# EAGLE design row_driver (EAGLE 7.7.0)
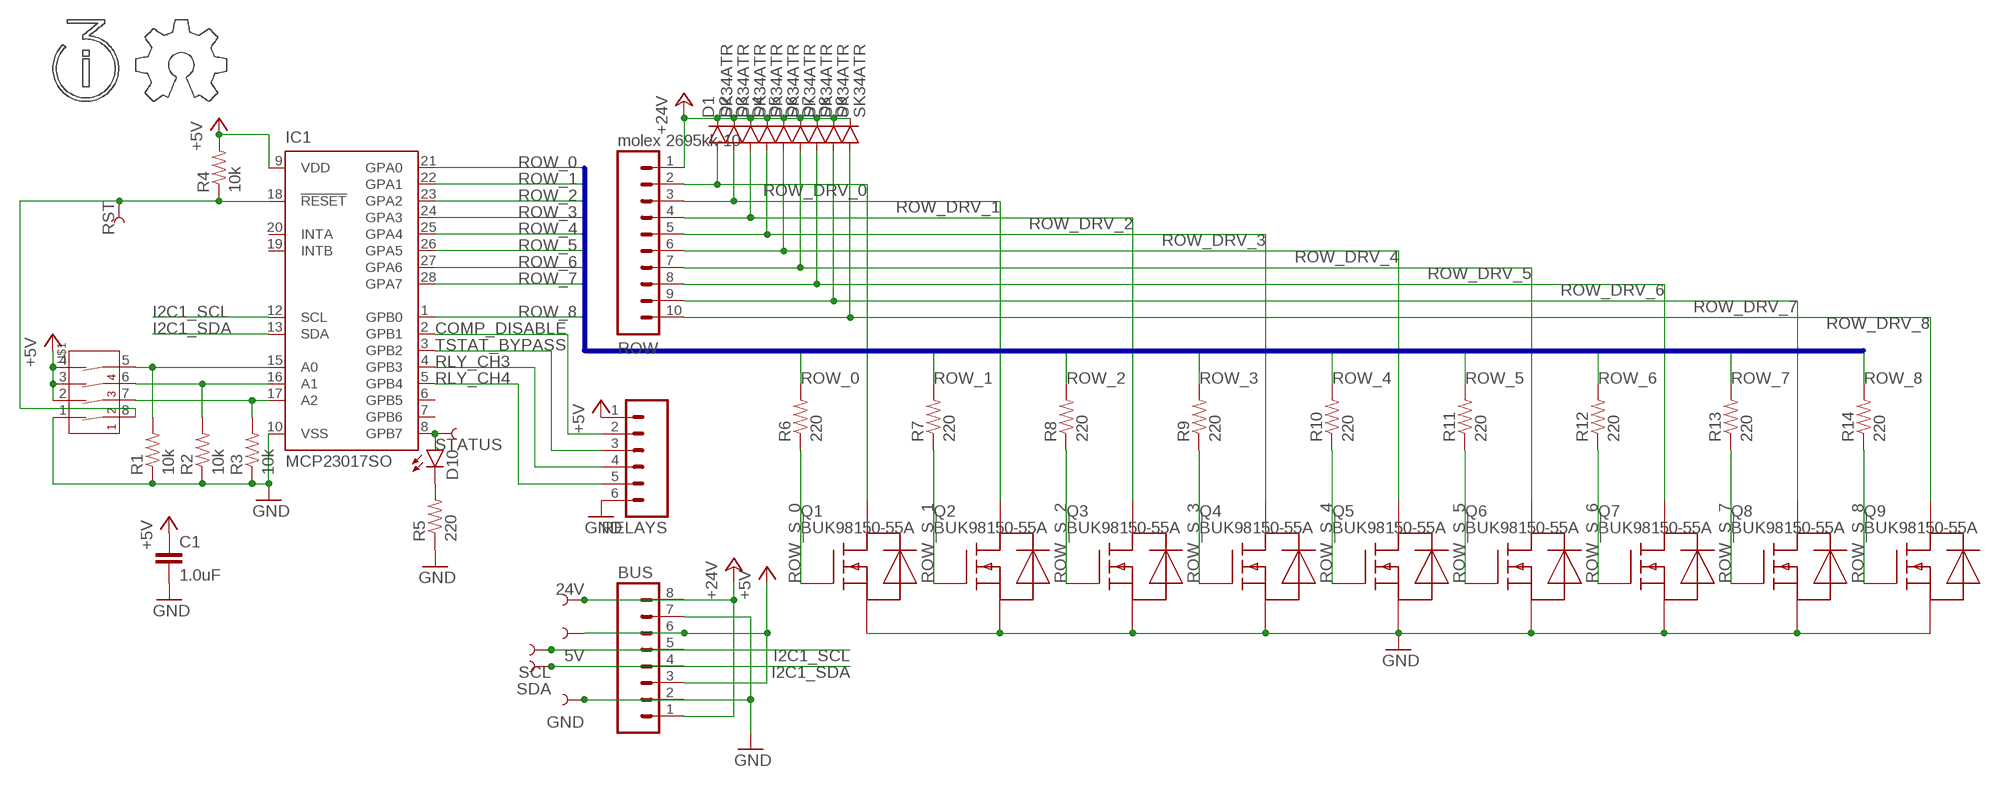
[diagram p0: schematic, sheet 1]

## Parts
5V  TEST-POINTTP_15TH_THRU  [TP_15TH]
24V  TEST-POINTTP_15TH_THRU  [TP_15TH]
BUS  M08FEMALE_LOCK  [1X08_FEMALE_LOCK]
C1  1.0uF  1.0UF-16V-10%(0603)  [0603-CAP]
D1  SK34ATR  DIODESMA  [SMA-DIODE]
D2  SK34ATR  DIODESMA  [SMA-DIODE]
D3  SK34ATR  DIODESMA  [SMA-DIODE]
D4  SK34ATR  DIODESMA  [SMA-DIODE]
D5  SK34ATR  DIODESMA  [SMA-DIODE]
D6  SK34ATR  DIODESMA  [SMA-DIODE]
D7  SK34ATR  DIODESMA  [SMA-DIODE]
D8  SK34ATR  DIODESMA  [SMA-DIODE]
D9  SK34ATR  DIODESMA  [SMA-DIODE]
D10  LED1206  [LED-1206]
GND  TEST-POINTTP_15TH_THRU  [TP_15TH]
IC1  MCP23017SO  [SO28W]
Q1  BUK98150-55A  [SOT223]
Q2  BUK98150-55A  [SOT223]
Q3  BUK98150-55A  [SOT223]
Q4  BUK98150-55A  [SOT223]
Q5  BUK98150-55A  [SOT223]
Q6  BUK98150-55A  [SOT223]
Q7  BUK98150-55A  [SOT223]
Q8  BUK98150-55A  [SOT223]
Q9  BUK98150-55A  [SOT223]
R1  10k  RESISTOR0805-RES  [0805]
R2  10k  RESISTOR0805-RES  [0805]
R3  10k  RESISTOR0805-RES  [0805]
R4  10k  RESISTOR0805-RES  [0805]
R5  220  RESISTOR0805-RES  [0805]
R6  220  RESISTOR0805-RES  [0805]
R7  220  RESISTOR0805-RES  [0805]
R8  220  RESISTOR0805-RES  [0805]
R9  220  RESISTOR0805-RES  [0805]
R10  220  RESISTOR0805-RES  [0805]
R11  220  RESISTOR0805-RES  [0805]
R12  220  RESISTOR0805-RES  [0805]
R13  220  RESISTOR0805-RES  [0805]
R14  220  RESISTOR0805-RES  [0805]
RELAYS  M06LOCK  [1X06_LOCK]
ROW  molex 2695kk-10  M10LOCK  [1X10_LOCK]
RST  TEST-POINTTP_15TH_THRU  [TP_15TH]
SCL  TEST-POINTTP_15TH_THRU  [TP_15TH]
SDA  TEST-POINTTP_15TH_THRU  [TP_15TH]
STATUS  TEST-POINTTP_15TH_THRU  [TP_15TH]
U$1  4-POS-DIP  [4-POS-DIP-SMD]
U$2  I3LOGO  [I3LOGO]
U$4  OSHWLOGO  [OSHWLOGO]

## Nets
+5V: 5V.P$1 BUS.3 BUS.6 C1.1 IC1.9(VDD) R4.2 RELAYS.1 U$1.2(2A) U$1.3(3A) U$1.4(4A)
+24V: 24V.P$1 BUS.1 BUS.8 D1.C D2.C D3.C D4.C D5.C D6.C D7.C D8.C D9.C ROW.1
A0: IC1.15(A0) R1.2 U$1.5(4B)
A1: IC1.16(A1) R2.2 U$1.6(3B)
A2: IC1.17(A2) R3.2 U$1.7(2B)
COMP_DISABLE: IC1.2(GPB1) RELAYS.2
GND: BUS.2 BUS.7 C1.2 GND.P$1 IC1.10(VSS) Q1.3(S) Q2.3(S) Q3.3(S) Q4.3(S) Q5.3(S) Q6.3(S) Q7.3(S) Q8.3(S) Q9.3(S) R1.1 R2.1 R3.1 R5.1 RELAYS.6 U$1.1(1A)
I2C1_SCL: BUS.5 IC1.12(SCL) SCL.P$1
I2C1_SDA: BUS.4 IC1.13(SDA) SDA.P$1
N$15: D10.C R5.2
RLY_CH3: IC1.4(GPB3) RELAYS.4
RLY_CH4: IC1.5(GPB4) RELAYS.5
ROW_0: IC1.21(GPA0) R6.2
ROW_1: IC1.22(GPA1) R7.2
ROW_2: IC1.23(GPA2) R8.2
ROW_3: IC1.24(GPA3) R9.2
ROW_4: IC1.25(GPA4) R10.2
ROW_5: IC1.26(GPA5) R11.2
ROW_6: IC1.27(GPA6) R12.2
ROW_7: IC1.28(GPA7) R13.2
ROW_8: IC1.1(GPB0) R14.2
ROW_DRV_0: D1.A Q1.2(D) Q1.4(D) ROW.2
ROW_DRV_1: D2.A Q2.2(D) Q2.4(D) ROW.3
ROW_DRV_2: D3.A Q3.2(D) Q3.4(D) ROW.4
ROW_DRV_3: D4.A Q4.2(D) Q4.4(D) ROW.5
ROW_DRV_4: D5.A Q5.2(D) Q5.4(D) ROW.6
ROW_DRV_5: D6.A Q6.2(D) Q6.4(D) ROW.7
ROW_DRV_6: D7.A Q7.2(D) Q7.4(D) ROW.8
ROW_DRV_7: D8.A Q8.2(D) Q8.4(D) ROW.9
ROW_DRV_8: D9.A Q9.2(D) Q9.4(D) ROW.10
ROW_S_0: Q1.1(G) R6.1
ROW_S_1: Q2.1(G) R7.1
ROW_S_2: Q3.1(G) R8.1
ROW_S_3: Q4.1(G) R9.1
ROW_S_4: Q5.1(G) R10.1
ROW_S_5: Q6.1(G) R11.1
ROW_S_6: Q7.1(G) R12.1
ROW_S_7: Q8.1(G) R13.1
ROW_S_8: Q9.1(G) R14.1
RST: IC1.18(!RESET) R4.1 RST.P$1 U$1.8(1B)
STATUS: D10.A IC1.8(GPB7) STATUS.P$1
TSTAT_BYPASS: IC1.3(GPB2) RELAYS.3
Unconnected: IC1.6(GPB5) IC1.7(GPB6) IC1.19(INTB) IC1.20(INTA)

## Buses
ROW_[0..8]

## Library data of the parts
5V 24V GND RST SCL SDA STATUS = SparkFun-Passives:TEST-POINT: Bare copper test points for troubleshooting or ICT
BUS = SparkFun-Connectors:M08: Header 8 Standard 8-pin 0.1" header. Use with straight break away headers (SKU : PRT-00116), right angle break away headers (PRT-00553), swiss pins (PRT-00743), machine pins (PRT-00117), and female headers (PRT-00115).
C1 = SparkFun-Capacitors:1.0UF-16V-10%(0603): CAP-00868; PROD_ID: CAP-00868
D1-D9 = SparkFun-DiscreteSemi:DIODE: Diode These are standard reverse protection diodes and small signal diodes. SMA package can handle up to about 1A. SOD-323 can handle about 200mA. What the SOD-323 package when ordering, there are some mfgs out there that are 5-pin packages.
D10 = SparkFun-LED:LED: LEDs Standard schematic elements and footprints for 5mm, 3mm, 1206, and 0603 sized LEDs. 5mm - Spark Fun Electronics SKU : COM-00529 (and others)
IC1 = microchip:MCP23017: http://ww1.microchip.com/downloads/en/DeviceDoc/21952a.pdf Source: http://ww1.microchip.com/downloads/en/DeviceDoc/21952a.pdf; MF: MICROCHIP; MPN: MCP23017-E/SO; OC_FARNELL: 1332087; OC_NEWARK: 31K2958
Q1-Q9 = vending:BUK98150-55A: N-channel TrenchMOS logic level FET Logic level N-channel enhancement mode Field-Effect Transistor (FET) in a plastic package using TrenchMOS technology. SOT223
R1-R14 = SparkFun-Passives:RESISTOR: Resistor Basic schematic elements and footprints for 0603, 1206, and PTH resistors.
RELAYS = SparkFun-Connectors:M06: Header 6 Standard 6-pin 0.1" header. Use with straight break away headers (SKU : PRT-00116), right angle break away headers (PRT-00553), swiss pins (PRT-00743), machine pins (PRT-00117), and female headers (PRT-00115). Molex polarized connector foot print use with SKU : PRT-08094 with associated crimp pins and housings. NOTES ON THE VARIANTS LOCK and LOCK_LONGPADS... This footprint was designed to help hold the alignment of a through-hole component (i.e. 6-pin header) while soldering it into place. You may notice that each hole has been shifted either up or down by 0.005 of an inch from it's more standard position (which is a perfectly straight line). This slight alteration caused the pins (the squares in the middle) to touch the edges of the holes. Because they are alternating, it causes a "brace" to hold the component in place. 0.005 has proven to be the perfect amount of "off-center" position when using our standard breakaway headers. Although looks a little odd when you look at the bare footprint, once you have a header in there, the alteration is very hard to notice. Also,if you push a header all the way into place, it is covered up entirely on the bottom side. This idea of altering the position of holes to aid alignment will be further integrated into the Sparkfun Library for other footprints. It can help hold any component with 3 or more connection pins.
ROW = SparkFun-Connectors:M10: Header 10 Standard 10-pin 0.1" header. Use with straight break away headers (SKU : PRT-00116), right angle break away headers (PRT-00553), swiss pins (PRT-00743), machine pins (PRT-00117), and female headers (PRT-00115).
U$1 = SparkFun-Electromechanical:4-POS-DIP: 4 Position DIP Switch CTS series 219; PROD_ID: SWCH-12418
U$2 = vending:I3LOGO: The i3Detroit square logo ("i3") as lines in the Info/tNames layers
U$4 = vending:OSHWLOGO: The OSHW logo as lines on Info/tNames layers

## Board
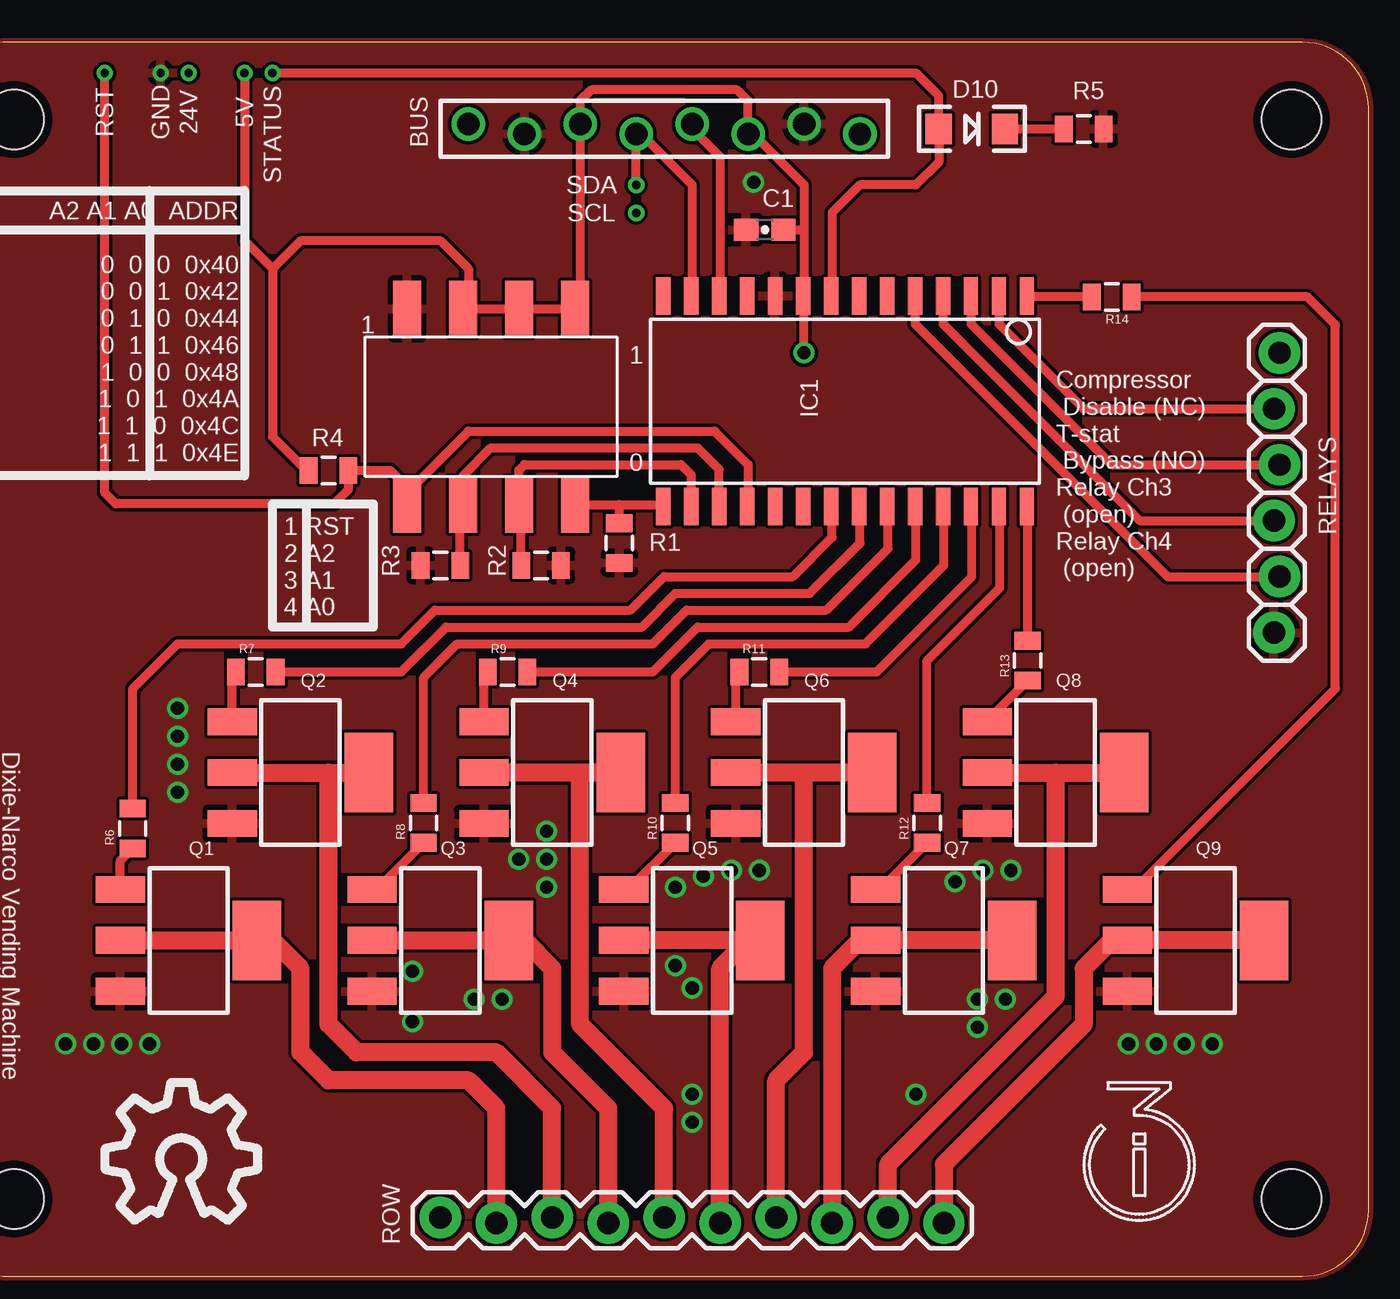
[diagram p1: board, top side]
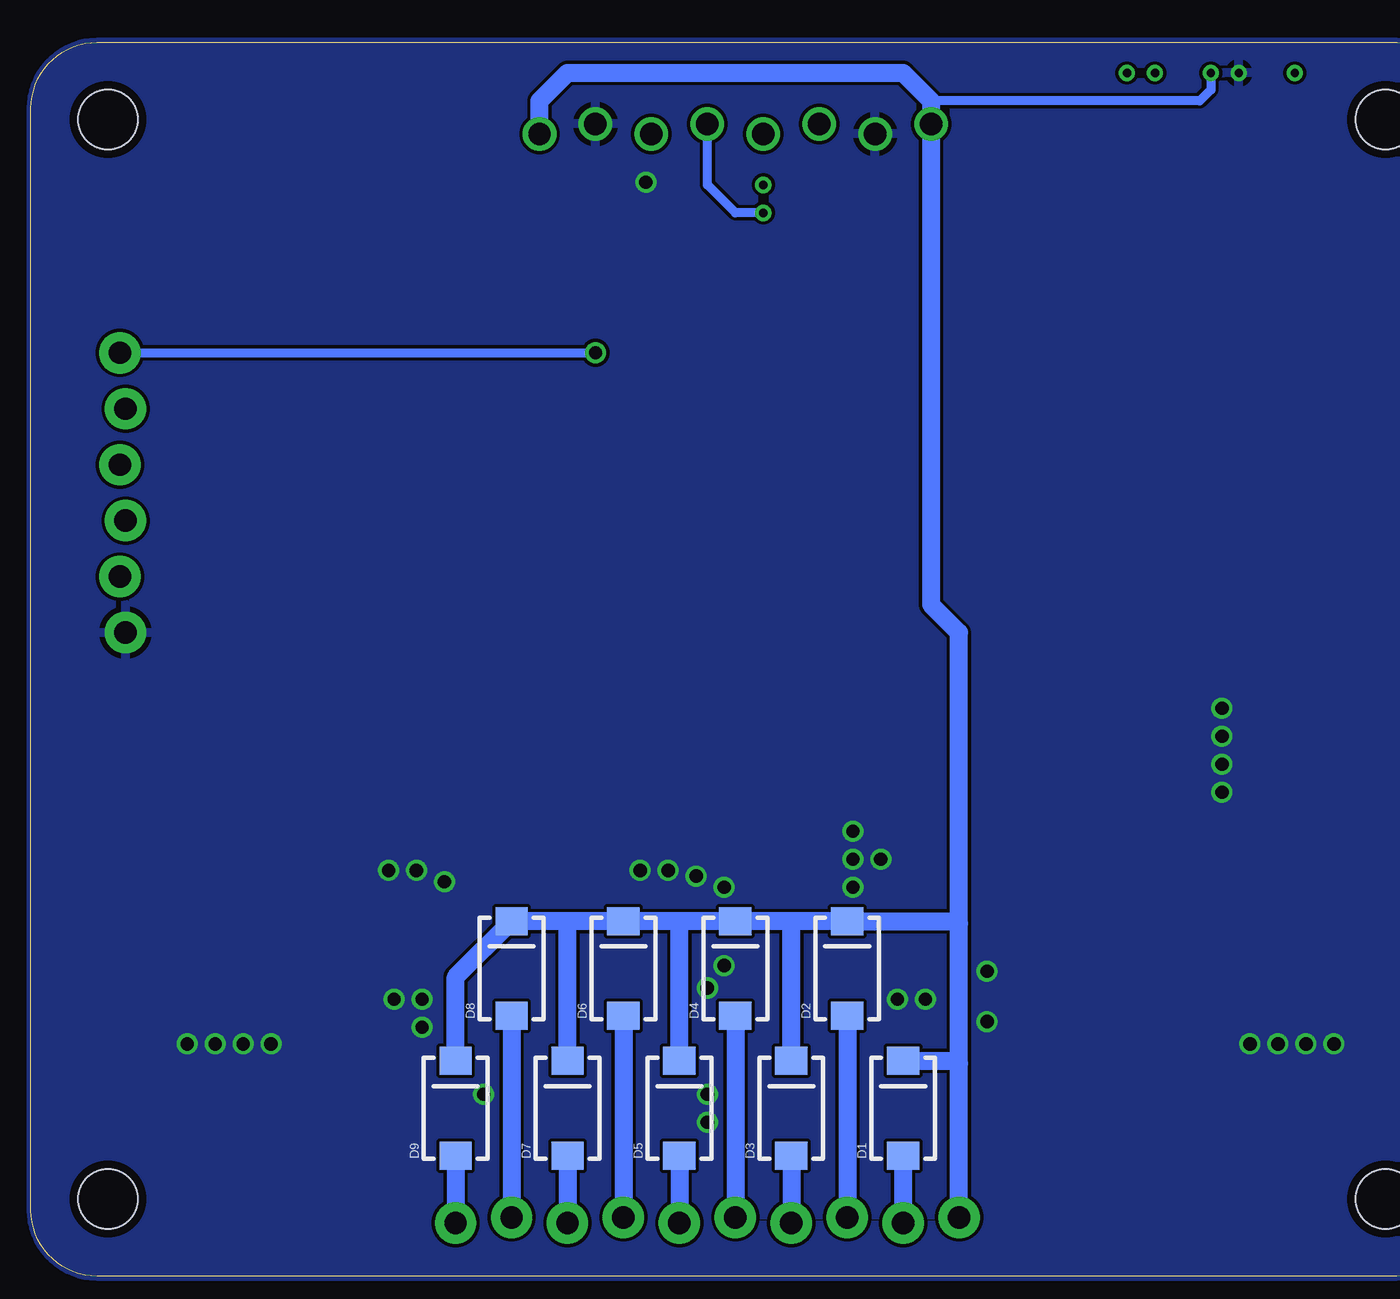
[diagram p2: board, bottom side, seen from below]

No outline drawn. Coordinates in mm, seen from the top.
Copper layers (1*16): Top 0.0356mm / dielectric 1.5011mm / Bottom 0.0356mm
Design rules "LaenPCBOrder": minimum track width 6mil, minimum drill 13mil, track to track 6mil, track to pad 6mil, pad to pad 6mil, via to via 6mil, smd to smd 6mil, copper to edge 15mil, drill to drill 6mil, minimum pad ring 7mil, minimum via ring 7mil, stop-mask expansion 4mil, vias tented up to drill 0mil, thermal gap 10mil
Holes 2.7 mm at 3.5,3.5 3.5,52.5 61.5,52.5 61.5,3.5
Milling: 8 lines

### Footprints (pad centres in the part's own frame; a part is rotated, then mirrored left to right if it is on the bottom)
TP_15TH = drill 0.381 pad 0.61: P$1 0,0
1X08_FEMALE_LOCK = drill 1.016: 1 0,0.229; 2 2.54,-0.229; 3 5.08,0.229; 4 7.62,-0.229; 5 10.16,0.229; 6 12.7,-0.229; 7 15.24,0.229; 8 17.78,-0.229
0603-CAP = smd 1.1 x 1: 1 -0.85,0; 2 0.85,0
SMA-DIODE = smd 1.27 x 1.47: A -2.15,0; C 2.15,0
LED-1206 = smd 1.2 x 1.4: A -1.5,0; C 1.5,0
SO28W = smd 0.65 x 1.7: 1 -7.62,-4.78; 2 -6.35,-4.78; 3 -5.08,-4.78; 4 -3.81,-4.78; 5 -2.54,-4.78; 6 -1.27,-4.78; 7 0,-4.78; 8 1.27,-4.78; 9 2.54,-4.78; 10 3.81,-4.78; 11 5.08,-4.78; 12 6.35,-4.78; 13 7.62,-4.78; 14 8.89,-4.78; 15 8.89,4.78; 16 7.62,4.78; 17 6.35,4.78; 18 5.08,4.78; 19 3.81,4.78; 20 2.54,4.78; 21 1.27,4.78; 22 0,4.78; 23 -1.27,4.78; 24 -2.54,4.78; 25 -3.81,4.78; 26 -5.08,4.78; 27 -6.35,4.78; 28 -7.62,4.78
SOT223 = smd 1.219 x 2.235: 1 -2.311,-3.099; 2 0,-3.099; 3 2.311,-3.099 | smd 3.6 x 2.2: 4 0,3.099
0805 = smd 0.8 x 1.2: 1 -0.9,0; 2 0.9,0
1X06_LOCK = drill 1.016 pad 1.88: 1 0,0; 2 2.54,-0.254; 3 5.08,0; 4 7.62,-0.254; 5 10.16,0; 6 12.7,-0.254
1X10_LOCK = drill 1.016 pad 1.88: 1 0,0.127; 2 2.54,-0.127; 3 5.08,0.127; 4 7.62,-0.127; 5 10.16,0.127; 6 12.7,-0.127; 7 15.24,0.127; 8 17.78,-0.127; 9 20.32,0.127; 10 22.86,-0.127
4-POS-DIP-SMD = smd 1.27 x 2.54: 1 -3.81,4.445; 2 -1.27,4.445; 3 1.27,4.445; 4 3.81,4.445; 5 3.81,-4.445; 6 1.27,-4.445; 7 -1.27,-4.445; 8 -3.81,-4.445

### Placement (x,y rotation side)
5V  13.97,54.61 90 top
24V  11.43,54.61 90 top
BUS  24.13,52.07 0 top
C1  37.59,47.5 180 top
D1  25.4,7.62 90 bottom
D2  27.94,13.97 90 bottom
D3  30.48,7.62 90 bottom
D4  33.02,13.97 90 bottom
D5  35.56,7.62 90 bottom
D6  38.1,13.97 90 bottom
D7  40.64,7.62 90 bottom
D8  43.18,13.97 90 bottom
D9  45.72,7.62 90 bottom
D10  46.99,52.07 0 top
GND  10.16,54.61 90 top
IC1  41.87,39.71 180 top
Q1  11.43,15.24 270 top
Q2  16.51,22.86 270 top
Q3  22.86,15.24 270 top
Q4  27.94,22.86 270 top
Q5  34.29,15.24 270 top
Q6  39.37,22.86 270 top
Q7  45.72,15.24 270 top
Q8  50.8,22.86 270 top
Q9  57.15,15.24 270 top
R1  30.99,33.27 90 top
R2  27.43,32.26 180 top
R3  22.86,32.26 0 top
R4  17.78,36.58 180 top
R5  52.07,52.07 180 top
R6  8.89,20.32 90 top
R7  14.48,27.43 0 top
R8  22.1,20.57 90 top
R9  25.91,27.43 0 top
R10  33.53,20.57 90 top
R11  37.34,27.43 0 top
R12  44.96,20.57 90 top
R13  49.53,27.94 90 top
R14  53.34,44.45 180 top
RELAYS  60.96,41.91 270 top
ROW  22.86,2.54 0 top
RST  7.62,54.61 90 top
SCL  31.75,48.26 0 top
SDA  31.75,49.53 0 top
STATUS  15.24,54.61 90 top
U$1  25.16,39.46 0 top
U$2  52.07,2.54 0 top
U$4  7.62,2.54 0 top

### Tracks (layer width: path | path; a pad name or v marks a point on that pad's centre or on a via)
+5V  (via drill 0.6)
  Top 0.406: 39.37,47.5 39.37,49.53 37.06,51.84 BUS.6 36.83,53.34 36.32,53.85 29.72,53.85 29.21,53.34 BUS.3 29.21,44.15 U$1.4 U$1.3 U$1.2 24.13,44.15 24.13,45.72 22.86,46.99 16.51,46.99 15.24,45.72 | 39.37,47.5 39.37,44.53 IC1.9 39.37,44.45 v39.37,41.91 | 15.24,45.72 15.24,38.1 16.51,36.83 16.63,36.83 R4.2 | 5V.P$1 13.97,46.99 15.24,45.72 | C1.1 39.37,47.5
  Bottom 0.406: RELAYS.1 v39.37,41.91
+24V
  Bottom 0.406: 24V.P$1 11.43,53.85 11.94,53.34 24.13,53.34
  Bottom 0.813: BUS.8 41.91,53.34 40.64,54.61 25.4,54.61 24.13,53.34 BUS.1 24.13,30.48 22.86,29.21 22.86,16 | ROW.1 22.86,9.65 | 22.86,9.65 22.86,16 | D1.C 22.98,9.77 22.86,9.65 | 22.86,16 22.98,16.12 D2.C 30.48,16.12 | 30.48,16.12 D4.C 35.56,16.12 | 35.56,16.12 D6.C 40.64,16.12 | 40.64,16.12 D8.C 45.72,13.58 D9.C | D7.C 40.64,16.12 | D5.C 35.56,16.12 | D3.C 30.48,16.12
A0
  Top 0.406: U$1.5 30.99,35.02 | 30.99,35.02 32.9,35.02 IC1.15 | R1.2 30.99,35.02
A1
  Top 0.406: IC1.16 34.25,36.36 33.78,36.83 26.67,36.83 26.43,36.59 U$1.6 26.53,34.91 R2.2
A2
  Top 0.406: IC1.17 35.52,36.62 34.54,37.59 25.15,37.59 23.89,36.34 U$1.7 23.76,34.88 R3.2
COMP_DISABLE
  Top 0.406: IC1.2 48.22,43.22 52.07,39.37 RELAYS.2
GND  (via drill 0.6)
  other vias: 37.08,49.66 47.24,12.57 33.53,14.1 24.38,12.57 34.8,18.16 26.42,18.92 27.69,18.92 27.69,17.65 27.69,20.19 36.07,18.41 33.53,17.65 37.34,18.41 34.29,13.08 34.29,8.26 34.29,6.99 47.24,11.3 48.51,12.57 44.45,8.26 25.65,12.57 21.59,11.56 21.59,13.84 10.92,25.78 10.92,24.51 10.92,23.24 10.92,21.97 5.84,10.54 7.11,10.54 8.38,10.54 9.65,10.54 48.77,18.41 47.5,18.41 46.23,17.91 54.1,10.54 55.37,10.54 56.64,10.54 57.91,10.54
  pour Bottom: 0,53 arc-90 3,56 62,56 arc-90 65,53 65,3 arc-90 62,0 3,0 arc-90 0,3
  pour Top: 0,3 0,53 arc-90 3,56 62,56 arc-90 65,53 65,3 arc-90 62,0 3,0 arc-90
I2C1_SCL
  Top 0.406: BUS.5 34.29,52.07 35.56,50.8 35.56,44.53 IC1.12
  Bottom 0.406: SCL.P$1 33.02,48.26 34.29,49.53 BUS.5
I2C1_SDA
  Top 0.406: IC1.13 34.29,44.53 34.29,49.53 31.98,51.84 BUS.4 SDA.P$1
N$15
  Top 0.406: D10.C R5.2
RLY_CH3
  Top 0.406: IC1.4 45.68,43.22 54.61,34.29 RELAYS.4
RLY_CH4
  Top 0.406: IC1.5 44.41,43.22 55.88,31.75 RELAYS.5
ROW_0
  Top 0.406: R6.2 8.89,26.67 10.92,28.7 21.08,28.7 22.61,30.23 31.5,30.23 33.02,31.75 38.86,31.75 40.64,33.53 40.64,34.89 IC1.21
ROW_1
  Top 0.406: R7.2 21.08,27.43 23.11,29.46 32,29.46 33.53,30.99 39.62,30.99 41.91,33.27 41.91,34.89 IC1.22
ROW_2
  Top 0.406: R8.2 22.1,27.18 23.62,28.7 32.51,28.7 34.04,30.23 40.39,30.23 43.18,33.02 43.18,34.89 IC1.23
ROW_3
  Top 0.406: R9.2 32.51,27.43 34.54,29.46 41.4,29.46 44.45,32.51 44.45,34.89 IC1.24
ROW_4
  Top 0.406: R10.2 33.53,27.18 35.05,28.7 42.16,28.7 45.72,32.26 45.72,34.89 IC1.25
ROW_5
  Top 0.406: R11.2 42.67,27.43 46.99,31.75 46.99,34.89 IC1.26
ROW_6
  Top 0.406: R12.2 44.96,27.94 48.26,31.24 48.26,34.89 IC1.27
ROW_7
  Top 0.406: R13.2 49.53,34.89 IC1.28
ROW_8
  Top 0.406: R14.2 49.53,44.45 IC1.1
ROW_DRV_0
  Top 0.813: Q1.2 Q1.4 15.24,15.24 16.51,13.97 16.51,10.16 17.78,8.89 24.13,8.89 25.4,7.62 ROW.2
  Bottom 0.813: D1.A ROW.2
ROW_DRV_1
  Top 0.813: Q2.2 17.78,22.86 | 17.78,22.86 Q2.4 | ROW.3 27.94,7.62 25.4,10.16 19.05,10.16 17.78,11.43 17.78,22.86
  Bottom 0.813: D2.A ROW.3
ROW_DRV_2
  Top 0.813: Q3.2 Q3.4 26.67,15.24 27.94,13.97 27.94,10.16 30.48,7.62 ROW.4
  Bottom 0.813: D3.A ROW.4
ROW_DRV_3
  Top 0.813: Q4.4 29.21,22.86 | 29.21,22.86 Q4.2 | ROW.5 33.02,7.62 29.21,11.43 29.21,22.86
  Bottom 0.813: D4.A ROW.5
ROW_DRV_4
  Top 0.406: Q5.4 36.83,15.24
  Top 0.813: Q5.2 36.83,15.24 35.56,13.97 ROW.6
  Bottom 0.813: D5.A ROW.6
ROW_DRV_5
  Top 0.813: Q6.4 39.37,22.86 | 39.37,22.86 Q6.2 | ROW.7 38.1,8.89 39.37,10.16 39.37,22.86
  Bottom 0.813: D6.A ROW.7
ROW_DRV_6
  Top 0.813: Q7.4 Q7.2 41.91,15.24 40.64,13.97 ROW.8
  Bottom 0.813: D7.A ROW.8
ROW_DRV_7
  Top 0.813: Q8.2 50.8,22.86 | 50.8,22.86 Q8.4 | ROW.9 43.18,5.08 50.8,12.7 50.8,22.86
  Bottom 0.813: D8.A ROW.9
ROW_DRV_8
  Top 0.813: ROW.10 45.72,5.08 52.07,11.43 52.07,13.97 53.34,15.24 Q9.2 Q9.4
  Bottom 0.813: D9.A ROW.10
ROW_S_0
  Top 0.406: Q1.1 8.33,18.86 R6.1
ROW_S_1
  Top 0.406: Q2.1 13.41,27.27 R7.1
ROW_S_2
  Top 0.406: Q3.1 19.98,17.55 R8.1
ROW_S_3
  Top 0.406: Q4.1 24.84,27.27 R9.1
ROW_S_4
  Top 0.406: Q5.1 31.41,17.55 R10.1
ROW_S_5
  Top 0.406: Q6.1 36.27,27.27 R11.1
ROW_S_6
  Top 0.406: Q7.1 42.84,17.55 R12.1
ROW_S_7
  Top 0.406: Q8.1 47.7,25.21 R13.1
ROW_S_8
  Top 0.406: Q9.1 54.38,17.55 63.5,26.67 63.5,43.18 62.23,44.45 R14.1
RST
  Top 0.406: 21.59,35.56 20.57,36.58 R4.1 18.68,35.7 18.03,35.05 8.13,35.05 7.62,35.56 RST.P$1 | 21.59,35.56 21.59,35.26 U$1.8 | 21.59,35.56 21.59,35.81 24.13,38.35 35.31,38.35 36.83,36.83 36.83,34.97 IC1.18
STATUS
  Top 0.406: IC1.8 40.64,44.53 40.64,48.26 41.91,49.53 44.45,49.53 45.49,50.57 D10.A 45.49,53.57 44.45,54.61 STATUS.P$1
TSTAT_BYPASS
  Top 0.406: IC1.3 46.95,43.22 53.34,36.83 RELAYS.3

### Text on the board
tNames: RST | GND | 24V | 5V | STATUS | SDA | A2 A1 A0 ADDR / / 0 0 0 0x40 / 0 0 1 0x42 / 0 1 0 0x44 / 0 1 1 0x46 / 1 0 0 0x48 / 1 0 1 0x4A / 1 1 0 0x4C / 1 1 1 0x4E | SCL | 1 | 1 / / / / 0 | Compressor / Disable (NC) / T-stat / Bypass (NO) / Relay Ch3 / (open) / Relay Ch4 / (open) | 1 RST / 2 A2 / 3 A1 / 4 A0 | Dixie-Narco Vending Machine / Row Driver v1.0 / https://www.i3detroit.org/wiki/Dixie_Narco_Soda_Machine